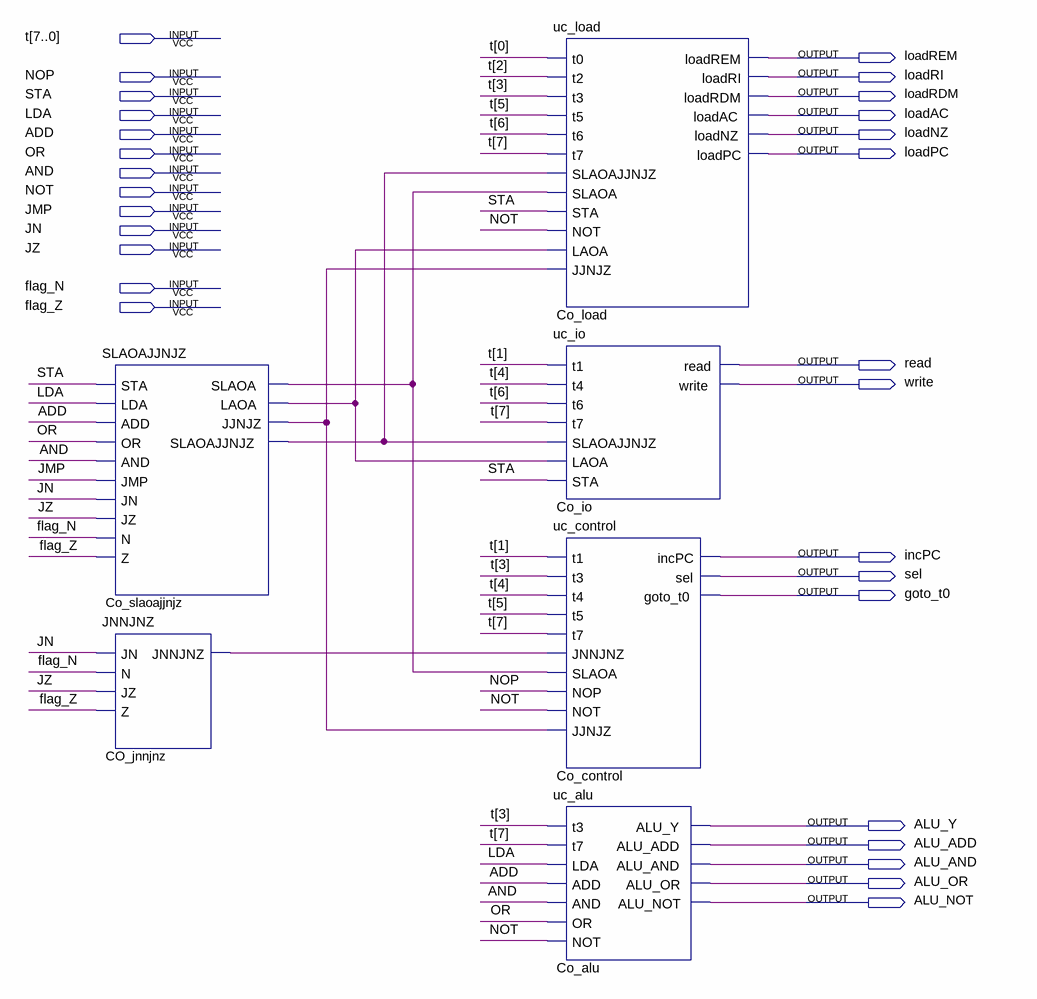
[diagram p0: schematic sheet]
// Quartus schematic control_unity.bdf as structural Verilog: 6 symbols, 29 pins
module control_unity (
  input  [7:0] t,
  input  NOP,
  input  STA,
  input  LDA,
  input  ADD,
  input  OR,
  input  AND,
  input  NOT,
  input  JMP,
  input  JN,
  input  JZ,
  input  flag_N,
  input  flag_Z,
  output loadREM,
  output loadRI,
  output loadRDM,
  output loadAC,
  output loadNZ,
  output loadPC,
  output read,
  output write,
  output incPC,
  output sel,
  output goto_t0,
  output ALU_Y,
  output ALU_ADD,
  output ALU_AND,
  output ALU_OR,
  output ALU_NOT
);

  wire CO_jnnjnz_jnnjnz, Co_slaoajjnjz_jjnjz, Co_slaoajjnjz_laoa, Co_slaoajjnjz_slaoa,
       Co_slaoajjnjz_slaoajjnjz;

  SLAOAJJNJZ Co_slaoajjnjz (
    .STA(STA), .LDA(LDA), .ADD(ADD), .OR(OR), .AND(AND), .JMP(JMP), .JN(JN), .JZ(JZ), .N(flag_N), .Z(flag_Z),
    .SLAOA(Co_slaoajjnjz_slaoa), .LAOA(Co_slaoajjnjz_laoa), .JJNJZ(Co_slaoajjnjz_jjnjz),
    .SLAOAJJNJZ(Co_slaoajjnjz_slaoajjnjz));
  JNNJNZ CO_jnnjnz (.JN(JN), .N(flag_N), .JZ(JZ), .Z(flag_Z), .JNNJNZ(CO_jnnjnz_jnnjnz));
  uc_load Co_load (
    .t0(t[0]), .t2(t[2]), .t3(t[3]), .t5(t[5]), .t6(t[6]), .t7(t[7]), .SLAOAJJNJZ(Co_slaoajjnjz_slaoajjnjz),
    .SLAOA(Co_slaoajjnjz_slaoa), .STA(STA), .NOT(NOT), .LAOA(Co_slaoajjnjz_laoa),
    .JJNJZ(Co_slaoajjnjz_jjnjz), .loadREM(loadREM), .loadRI(loadRI), .loadRDM(loadRDM), .loadAC(loadAC),
    .loadNZ(loadNZ), .loadPC(loadPC));
  uc_io Co_io (
    .t1(t[1]), .t4(t[4]), .t6(t[6]), .t7(t[7]), .SLAOAJJNJZ(Co_slaoajjnjz_slaoajjnjz),
    .LAOA(Co_slaoajjnjz_laoa), .STA(STA), .read(read), .write(write));
  uc_control Co_control (
    .t1(t[1]), .t3(t[3]), .t4(t[4]), .t5(t[5]), .t7(t[7]), .JNNJNZ(CO_jnnjnz_jnnjnz),
    .SLAOA(Co_slaoajjnjz_slaoa), .NOP(NOP), .NOT(NOT), .JJNJZ(Co_slaoajjnjz_jjnjz), .incPC(incPC), .sel(sel),
    .goto_t0(goto_t0));
  uc_alu Co_alu (
    .t3(t[3]), .t7(t[7]), .LDA(LDA), .ADD(ADD), .AND(AND), .OR(OR), .NOT(NOT), .ALU_Y(ALU_Y),
    .ALU_ADD(ALU_ADD), .ALU_AND(ALU_AND), .ALU_OR(ALU_OR), .ALU_NOT(ALU_NOT));
endmodule
